# EAGLE schematic circuit_design (EAGLE 9.3.0)
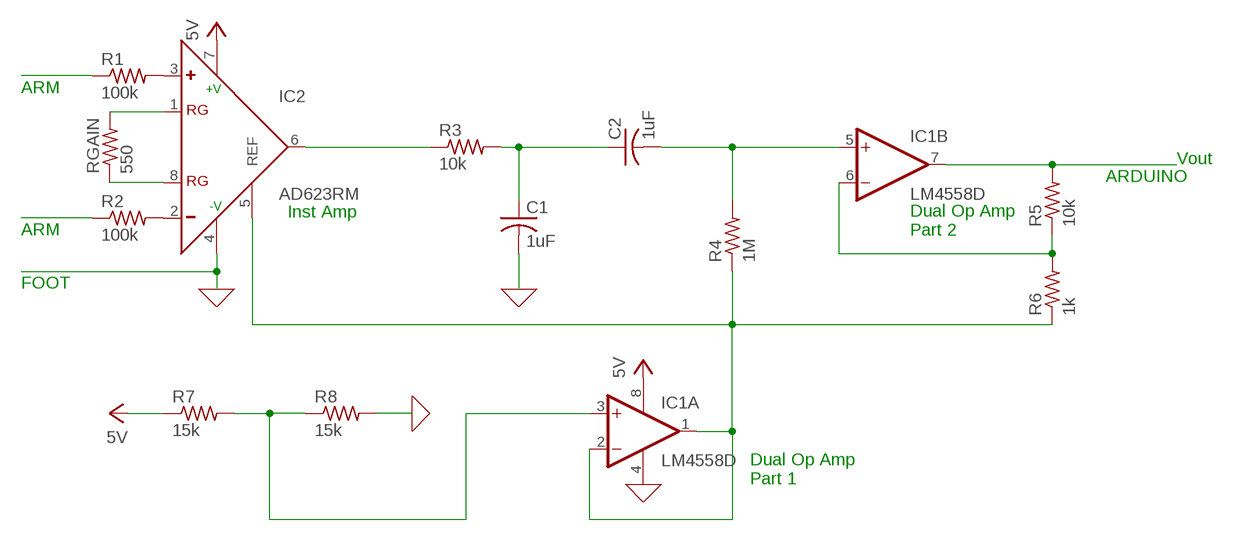
[diagram p0: schematic, sheet 1]

## Parts
C1  1uF  C-USC0805  [C0805]
C2  1uF  C-USC0805  [C0805]
IC1  LM4558D  [SO08]
IC2  AD623RM  [MSOP08]
R1  100k  R-US_M0805  [M0805]
R2  100k  R-US_M0805  [M0805]
R3  10k  R-US_M0805  [M0805]
R4  1M  R-US_M0805  [M0805]
R5  10k  R-US_M0805  [M0805]
R6  1k  R-US_M0805  [M0805]
R7  15k  R-US_M0805  [M0805]
R8  15k  R-US_M0805  [M0805]
RGAIN  550  R-US_M0805  [M0805]

## Nets
0: IC1.4(P:V-) R8.2 ; supply symbol labelled GND
N$1: IC2.1(RG) RGAIN.2
N$2: IC2.8(RG) RGAIN.1
N$3: IC2.3(+) R1.2
N$4: IC2.2(-) R2.2
N$5: R1.1
N$6: R2.1
N$7: IC2.4(-V) ; supply symbol labelled GND
N$8: IC2.6(OUT) R3.1
N$9: C1.1 C2.1 R3.2
N$10: C1.2 ; supply symbol labelled GND
N$11: C2.2 IC1.5(B:+IN) R4.2
N$13: IC1.7(B:OUT) R5.2
N$14: IC1.1(A:OUT) IC1.2(A:-IN) IC2.5(REF) R4.1 R6.1
N$15: IC1.3(A:+IN) R7.2 R8.1
N$16: IC1.6(B:-IN) R5.1 R6.2
VCC: IC1.8(P:V+) IC2.7(+V) R7.1 ; supply symbol labelled 5V

## Notes on the sheet
- ARM
- Vout
- ARDUINO
- Inst Amp
- ARM
- Dual Op Amp
  Part 2
- FOOT
- Dual Op Amp
  Part 1

## Library data of the parts
C1 C2 = rcl:C-US: CAPACITOR, American symbol; SPICEPREFIX: C
IC1 = linear:*4558: OP AMP
IC2 = analog-devices:AD623: Single-Supply, Rail-to-Rail, Low Cost Instrumentation Amplifier Source: http://www.analog.com/static/imported-files/data_sheets/AD623.pdf; MPN: AD623ARMZ; OC_FARNELL: 1660961; OC_NEWARK: 19M8824
R1-R8 RGAIN = rcl:R-US_: RESISTOR, American symbol; SPICEPREFIX: R